# EAGLE design MAX31855_breakout (EAGLE 7.6.0)
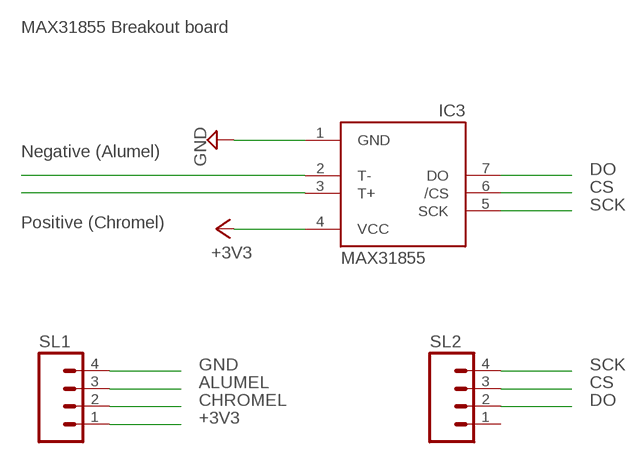
[diagram p0: schematic, sheet 1]

## Parts
IC3  MAX6675  [SO08]
SL1  M04  [04P]
SL2  M04  [04P]

## Nets
+3V3: IC3.4(VCC) SL1.1
ALUMEL: IC3.2(T-) SL1.3
CHROMEL: IC3.3(T+) SL1.2
CS: IC3.6(/CS) SL2.3
DO: IC3.7(DO) SL2.2
GND [Power]: IC3.1(GND) SL1.4
SCK: IC3.5(SCK) SL2.4
Unconnected: SL2.1

## Notes on the sheet
- MAX31855 Breakout board
- Negative (Alumel)
- DO
- CS
- SCK
- Positive (Chromel)
- MAX31855

## Library data of the parts
IC3 = adafruit:MAX6675
SL1 SL2 = con-amp-quick:M04: AMP QUICK CONNECTOR; OC_FARNELL: unknown; OC_NEWARK: unknown

## Net classes
0 default: width 0.152 mm, clearance 0.152 mm
1 Power: width 1.016 mm, drill 0.61 mm, clearance 0.61 mm

## Board
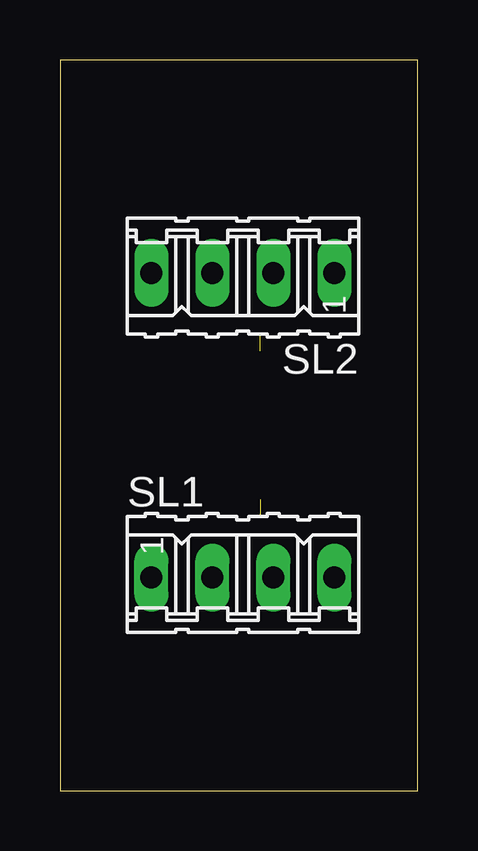
[diagram p1: board, top side]
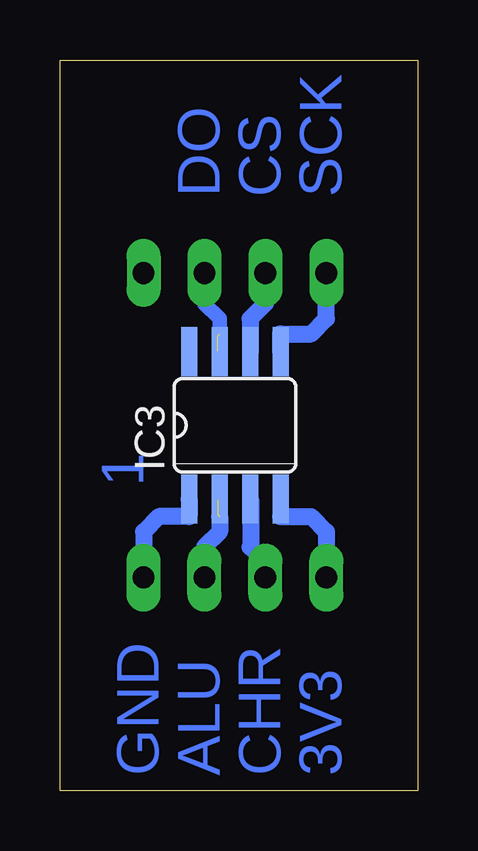
[diagram p2: board, bottom side, seen from below]

Size 14.91 x 30.47 mm. Coordinates in mm from the lower left corner, seen from the top.
Outline: 0,0 14.91,0 14.91,30.47 0,30.47 0,0
Copper layers (1*16): Top 0.035mm / dielectric 1.5mm / Bottom 0.035mm
Design rules "default": minimum track width 10mil, minimum drill 24mil, track to track 8mil, track to pad 8mil, pad to pad 8mil, via to via 8mil, smd to smd 8mil, copper to edge 40mil, drill to drill 8mil, minimum pad ring 10mil, minimum via ring 8mil, stop-mask expansion 4mil, vias tented up to drill 0mil, thermal gap 10mil

### Footprints (pad centres in the part's own frame; a part is rotated, then mirrored left to right if it is on the bottom)
SO08 = smd 0.66 x 2.032: 1 -1.905,-3.073; 2 -0.635,-3.073; 3 0.635,-3.073; 4 1.905,-3.073; 5 1.905,3.073; 6 0.635,3.073; 7 -0.635,3.073; 8 -1.905,3.073
04P = drill 0.914 long: 1 -3.81,0; 2 -1.27,0; 3 1.27,0; 4 3.81,0

### Placement (x,y rotation side)
IC3  7.62,15.24 0 bottom
SL1  7.62,8.89 0 top
SL2  7.62,21.59 180 top

### Tracks (layer width: path | path; a pad name or v marks a point on that pad's centre or on a via)
+3V3
  Bottom 0.254: 3.89,8.95 SL1.1
  Bottom 0.406: IC3.4 5.71,11.43
  Bottom 0.711: 5.71,11.43 4.45,11.43 3.81,10.79 SL1.1
ALUMEL  (2 unrouted)
  Bottom 0.254: 8.34,12.15 IC3.2
  Bottom 0.711: 8.26,11.43 8.26,10.79 8.89,10.16 SL1.3
CHROMEL
  Bottom 0.254: 6.97,12.15 IC3.3 | 6.4,8.95 SL1.2
  Bottom 0.711: 6.97,12.15 6.97,10.17 6.99,10.16 6.35,9.53 SL1.2
CS
  Bottom 0.254: 6.97,18.33 IC3.6
  Bottom 0.711: 6.97,18.33 6.97,19.67 6.99,19.68 6.35,20.32 SL2.3
DO  (2 unrouted)
  Bottom 0.254: 8.34,18.33 IC3.7
  Bottom 0.61: 8.26,19.05 8.26,19.68 8.89,20.32 SL2.2
GND
  Bottom 0.711: IC3.1 9.53,11.43 10.79,11.43 11.43,10.79 SL1.4
SCK
  Bottom 0.711: IC3.5 5.71,19.05 4.45,19.05 3.81,19.68 SL2.4

### Text on the board
Bottom: SCK | CS | DO | 1 | 3V3 | CHR | ALU | GND